# EAGLE design 10MHzRefOsc_2V3 (EAGLE 7.7.0)
DF4IAH - 10 MHz Reference Oscillator

## Sheet 1 of 3: Main
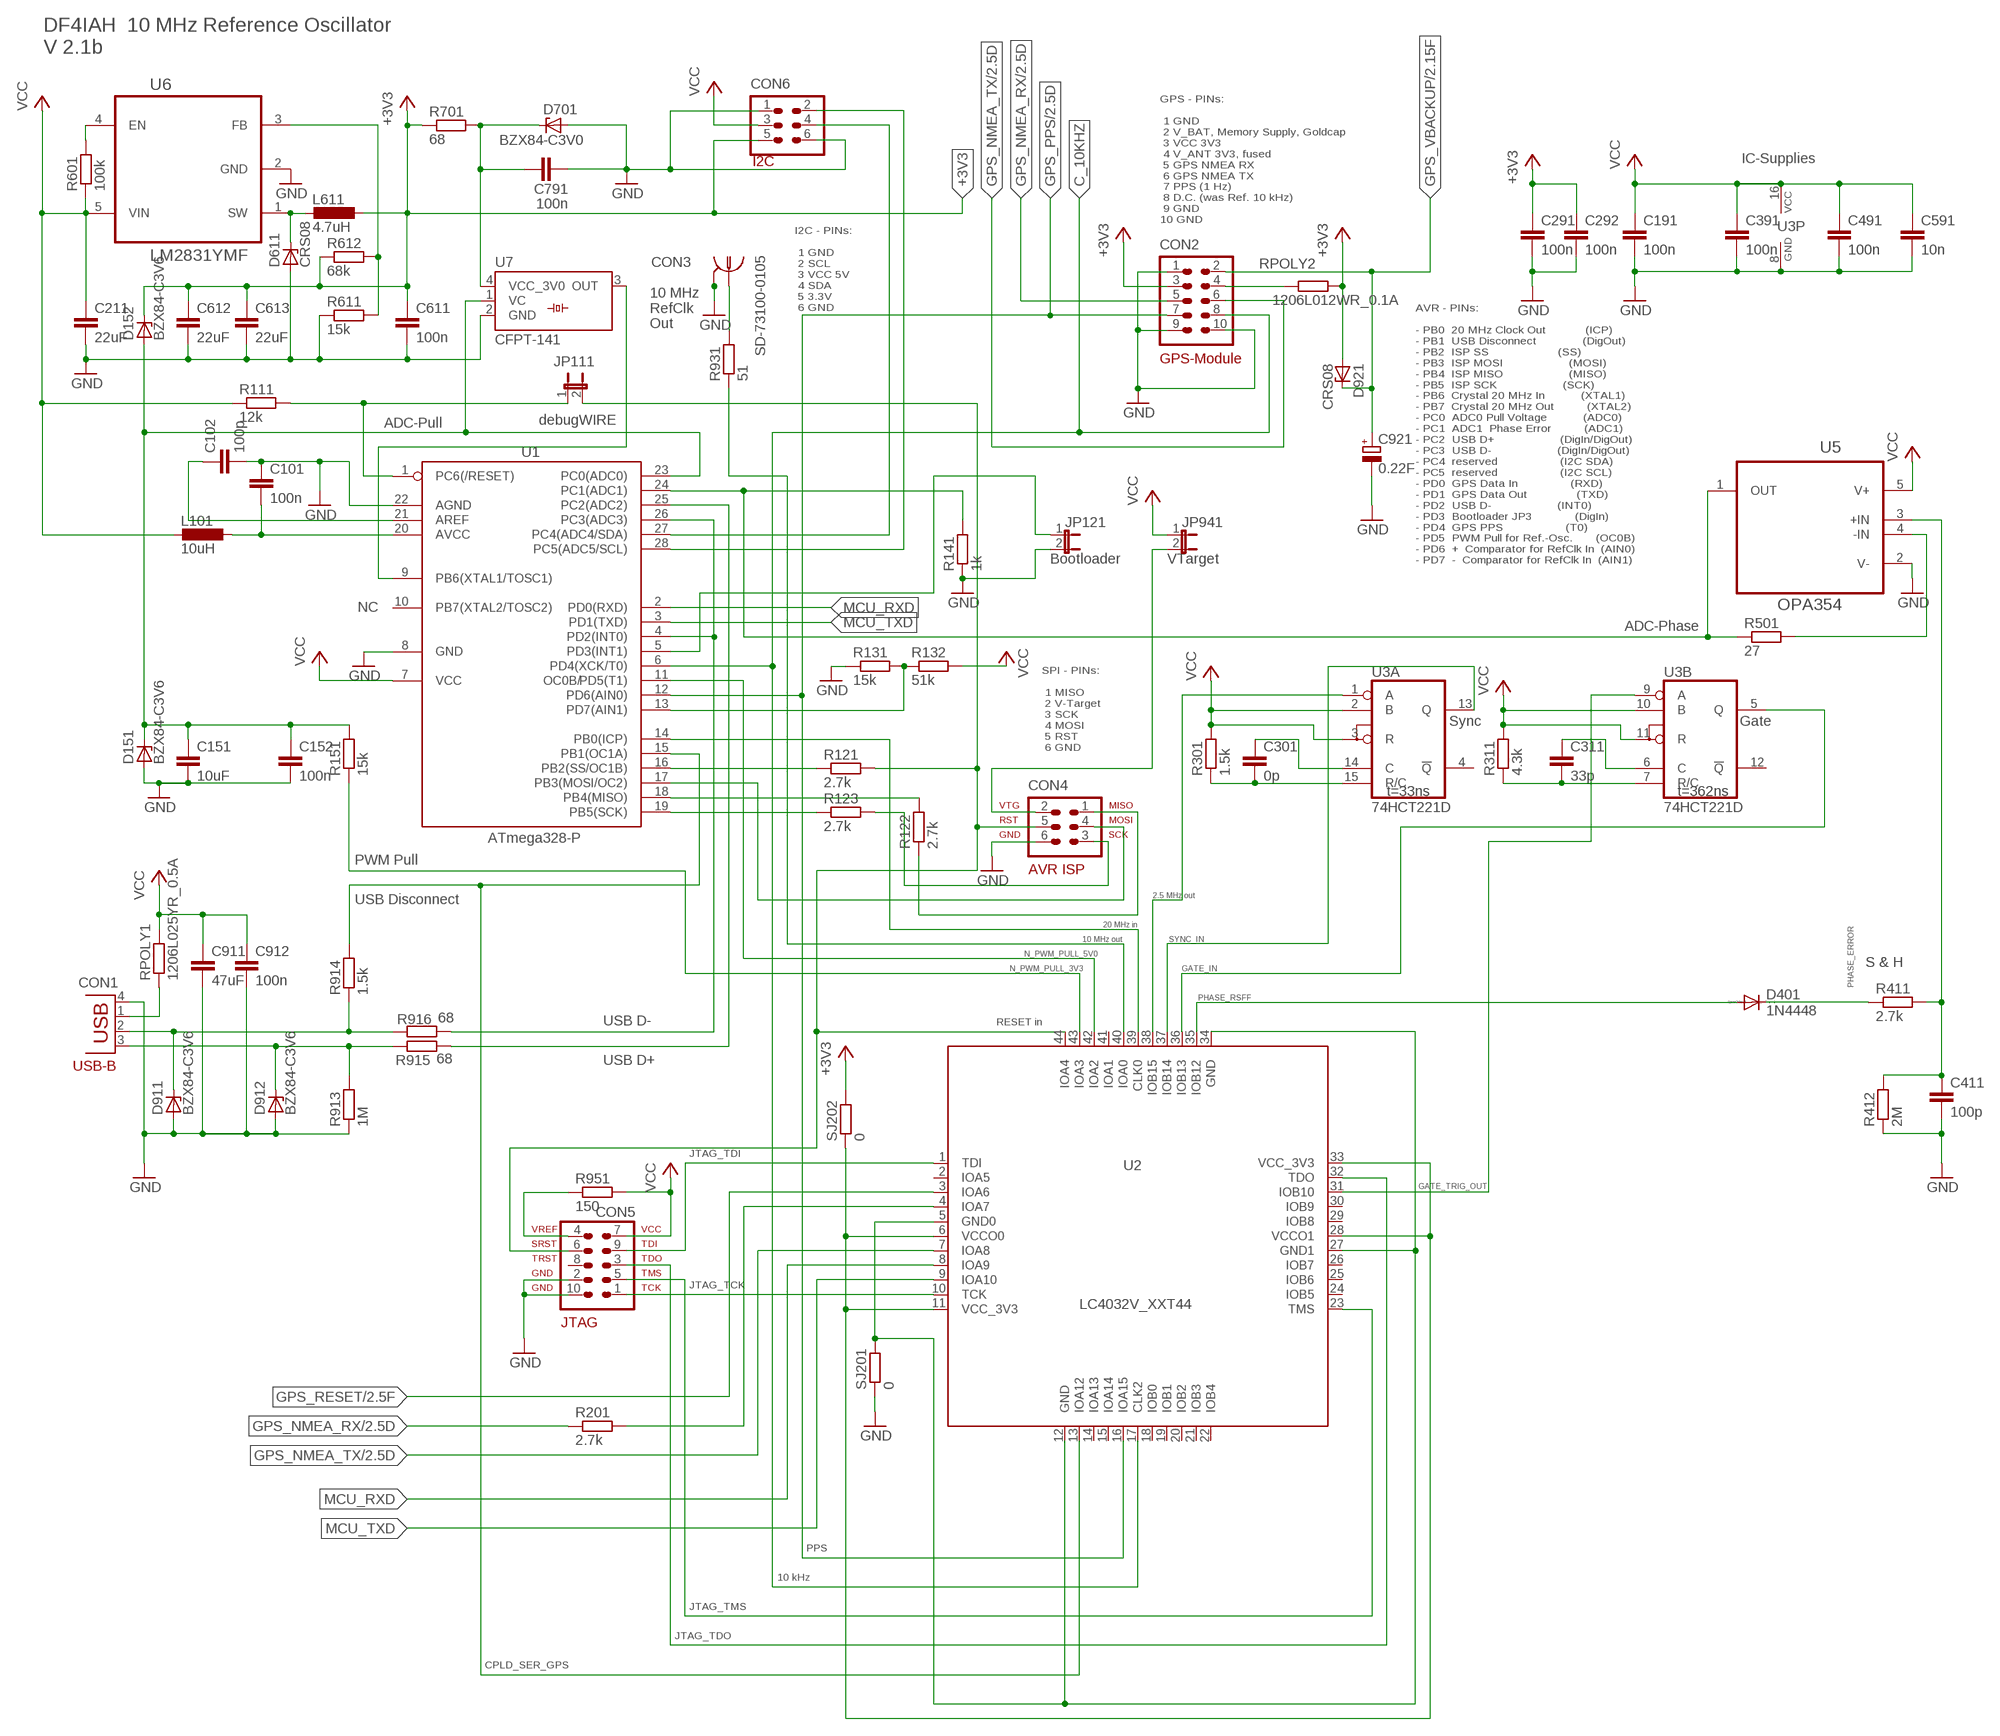
[diagram p0: schematic, sheet 1]

### Parts
C101  100n  C-EUC0805  [C0805]
C102  100p  C-EUC0805  [C0805]
C151  10uF  C-EUC0805  [C0805]
C152  100n  C-EUC0805  [C0805]
C191  100n  C-EUC0805  [C0805]
C211  22uF  C-EUC0805  [C0805]
C291  100n  C-EUC0805  [C0805]
C292  100n  C-EUC0805  [C0805]
C301  0p  C-EUC0805  [C0805]
C311  33p  C-EUC0805  [C0805]
C391  100n  C-EUC0805  [C0805]
C411  100p  C-EUC0805  [C0805]
C491  100n  C-EUC0805  [C0805]
C591  10n  C-EUC0805  [C0805]
C611  100n  C-EUC0805  [C0805]
C612  22uF  C-EUC0805  [C0805]
C613  22uF  C-EUC0805  [C0805]
C791  100n  C-EUC0805  [C0805]
C911  47uF  C-EUC0805  [C0805]
C912  100n  C-EUC0805  [C0805]
C921  0.22F  CPOL-EU140CLH-1010  [140CLH-1010]
CON1  TYCO-AMP_USBUSB-B_SMT  [TYCO-AMP_USB-B_SMT]
CON2  HEADER-2X5SMD  [2X5SMD]
CON3  SD-73100-0105  MOLEX_BNC-JACK-50R_SD-73100-0105  [MOLEX_BNC-JACK-50R_SD-73100-0105]
CON4  AVR-ISP-6SMD  [2X3SMD]
CON5  AVR-JTAG-10SMD  [2X5SMD]
CON6  HEADER-2X3SMD  [2X03SMD]
D151  BZX84-C3V6  BZX84CSMD  [TO236]
D152  BZX84-C3V6  BZX84CSMD  [TO236]
D401  1N4448  DIODE-SOD123  [SOD123]
D611  CRS08  ZENER-DIODESOD80C  [SOD80C]
D701  BZX84-C3V0  BZX84CSMD  [TO236]
D911  BZX84-C3V6  BZX84CSMD  [TO236]
D912  BZX84-C3V6  BZX84CSMD  [TO236]
D921  CRS08  ZENER-DIODESOD80C  [SOD80C]
JP111  JP1E  [JP1]
JP121  JP1E  [JP1]
JP941  JP1E  [JP1]
L101  10uH  L-EUL1812  [L1812]
L611  4.7uH  L-EUL5650M  [L5650M]
R111  12k  R-EU_R0805  [R0805]
R121  2.7k  R-EU_R0805  [R0805]
R122  2.7k  R-EU_R0805  [R0805]
R123  2.7k  R-EU_R0805  [R0805]
R131  15k  R-EU_R0805  [R0805]
R132  51k  R-EU_R0805  [R0805]
R141  1k  R-EU_R0805  [R0805]
R151  15k  R-EU_R0805  [R0805]
R201  2.7k  R-EU_R0805  [R0805]
R301  1.5k  R-EU_R0805  [R0805]
R311  4.3k  R-EU_R0805  [R0805]
R411  2.7k  R-EU_R0805  [R0805]
R412  2M  R-EU_R0805  [R0805]
R501  27  R-EU_R0805  [R0805]
R601  100k  R-EU_R0805  [R0805]
R611  15k  R-EU_R0805  [R0805]
R612  68k  R-EU_R0805  [R0805]
R701  68  R-EU_R0805  [R0805]
R913  1M  R-EU_R0805  [R0805]
R914  1.5k  R-EU_R0805  [R0805]
R915  68  R-EU_R0805  [R0805]
R916  68  R-EU_R0805  [R0805]
R931  51  R-EU_R0805  [R0805]
R951  150  R-EU_R0805  [R0805]
RPOLY1  1206L025YR_0.5A  R-EU_M1206  [M1206]
RPOLY2  1206L012WR_0.1A  R-EU_M1206  [M1206]
SJ201  0  R-EU_R0805  [R0805]
SJ202  0  R-EU_R0805  [R0805]
U1  ATmega328-P  MEGA8-P  [DIL28-3]
U2  LC4032V_XXT44  [TQFP44]
U3  74HCT221D  [SO16]
U5  OPA354  [SOT-23-5]
U6  LM2831YMF  [SOT95P280X145-5N]
U7  CFPT-141  [CFPT-141]

### Nets
+3V0 [N3V3]: C791.1 D701.C R701.2 U7.4(VCC_3V0)
+3V3 [N3V3]: C291.1 C292.1 C611.1 C612.1 C613.1 CON2.3 CON6.5 D152.C D921.A L611.1 R612.1 R701.1 RPOLY2.2 SJ202.2 ; also sheet 2
ADC_PHASE: R141.2 R501.1 U1.24(PC1(ADC1)) U5.1(OUT)
ADC_PHASE_SAMPLEHOLD: C411.1 R411.2 R412.2 U5.3(+IN)
AIN1: R131.2 R132.1 U1.13(PD7(AIN1))
AREF: C102.1 U1.21(AREF)
AVCC: C101.2 L101.1 U1.20(AVCC)
C_2MHZ5: U2.38(IOB15) U3.1(A:A)
C_10KHZ: CON2.8 U1.6(PD4(XCK/T0)) U2.17(CLK2)
C_10MHZ: R931.1 U2.40(IOA0)
C_20MHZ: U1.14(PB0(ICP)) U2.39(CLK0)
CPLD_GPS_NMEA_RX: R201.2 U2.4(IOA7)
EN: R601.2 U6.4(EN)
FB: R611.2 R612.2 U6.3(FB)
GATE_IN: U2.36(IOB13) U3.5(B:Q)
GATE_TRIG_OUT: U2.31(IOB10) U3.9(B:A)
GND [N0V]: C101.1 C102.2 C151.2 C152.2 C191.2 C211.2 C291.2 C292.2 C391.2 C411.2 C491.2 C591.2 C611.2 C612.2 C613.2 C791.2 C911.2 C912.2 C921.- CON1.4(GND) CON2.1 CON2.9 CON2.10 CON3.2 CON3.3 CON4.6 CON5.2 CON5.10 CON6.1 CON6.6 D151.A D611.A D701.A D911.A D912.A JP121.2 R131.1 R141.1 R412.1 R611.1 R913.1 SJ201.1 U1.8(GND) U1.22(AGND) U3.8(P:GND) U5.2(V-) U6.2(GND) U7.2(GND) ; also sheet 2,3
GND_SJ1: SJ201.2 U2.5(GND0) U2.12(GND) U2.27(GND1) U2.34(GND)
GPS_ANT_PWR [N5V]: CON2.4 RPOLY2.1
GPS_NMEA_RX: CON2.5 R201.1 ; also sheet 2
GPS_NMEA_TX: CON2.6 U2.7(IOA8) ; also sheet 2
GPS_PPS: CON2.7 U1.12(PD6(AIN0)) U2.16(IOA15) ; also sheet 2
GPS_RESET: U2.3(IOA6) ; also sheet 2
GPS_VBACKUP: C921.+ CON2.2 D921.C ; also sheet 2
INT1: JP121.1 U1.5(PD3(INT1))
ISP_MISO: CON4.1 R122.1
ISP_MOSI: CON4.4 U1.17(PB3(MOSI/OC2))
ISP_SCK: CON4.3 R123.2
ISP_VTARGET: CON4.2 JP941.2
JTAG_SRST: CON4.5 CON5.6 JP111.2 R121.2 U2.44(IOA4)
JTAG_TCK: CON5.1 U2.10(TCK)
JTAG_TDI: CON5.9 U2.1(TDI)
JTAG_TDO: CON5.3 U2.32(TDO)
JTAG_TMS: CON5.5 U2.23(TMS)
JTAG_VREF: CON5.4 R951.1
MCU_RXD: U1.2(PD0(RXD)) U2.8(IOA9)
MCU_TXD: U1.3(PD1(TXD)) U2.9(IOA10)
MISO: R122.2 U1.18(PB4(MISO))
N$1: CON6.2 U1.28(PC5(ADC5/SCL))
N$3: CON6.4 U1.27(PC4(ADC4/SDA))
N$42: CON3.1 R931.2
N$44: C311.2 R311.1 U3.7(B:R/C)
N$45: C311.1 U3.6(B:C)
N$47: C301.2 R301.1 U3.15(A:R/C)
N$48: C301.1 U3.14(A:C)
N_ADC_PULL: C151.1 C152.1 D151.C D152.A R151.2 U1.23(PC0(ADC0)) U7.1(VC)
N_PWM_PULL_3V3: R151.1 U2.43(IOA3)
N_PWM_PULL_5V0: U1.11(PD5(T1)) U2.42(IOA2)
N_USB_DISC: R914.2 U1.15(PB1(OC1A)) U2.13(IOA12)
N_USB_DMNS: R916.2 U1.4(PD2(INT0)) U1.26(PC3(ADC3))
N_USB_DPLS: R915.2 U1.25(PC2(ADC2))
PHASE_ERROR: D401.C R411.1
PHASE_RSFF: D401.A U2.35(IOB12)
RESET: JP111.1 R111.2 U1.1(PC6(/RESET))
SCK: R123.1 U1.19(PB5(SCK))
SS: R121.1 U1.16(PB2(SS/OC1B))
SW [N3V3]: D611.C L611.2 U6.1(SW)
SYNC_IN: U2.37(IOB14) U3.13(A:Q)
TOSC1: U1.9(PB6(XTAL1/TOSC1)) U7.3(OUT)
U5_FB: R501.2 U5.4(-IN)
USB_D_MIN: CON1.2(D-) D911.C R914.1 R916.1
USB_D_PLS: CON1.3(D+) D912.C R913.2 R915.1
USB_PWR: CON1.1(VBUS) RPOLY1.1
VCC [N5V]: C191.1 C211.1 C391.1 C491.1 C591.1 C911.1 C912.1 CON5.7 CON6.3 JP941.1 L101.2 R111.1 R132.2 R301.2 R311.2 R601.1 R951.2 RPOLY1.2 U1.7(VCC) U3.2(A:B) U3.3(A:R) U3.10(B:B) U3.11(B:R) U3.16(P:VCC) U5.5(V+) U6.5(VIN)
VCC_3V3_SJ2: SJ202.1 U2.6(VCCO0) U2.11(VCC_3V3) U2.28(VCCO1) U2.33(VCC_3V3)
Unconnected: CON5.8 U1.10(PB7(XTAL2/TOSC2)) U2.2(IOA5) U2.14(IOA13) U2.15(IOA14) U2.18(IOB0) U2.19(IOB1) U2.20(IOB2) U2.21(IOB3) U2.22(IOB4) U2.24(IOB5) U2.25(IOB6) U2.26(IOB7) U2.29(IOB8) U2.30(IOB9) U2.41(IOA1) U3.4(A:!Q) U3.12(B:!Q)

### Notes on the sheet
- DF4IAH  10 MHz Reference Oscillator
  V 2.1b
- I2C | IC-Supplies
- GPS - PINs:
  
   1 GND
   2 V_BAT, Memory Supply, Goldcap
   3 VCC 3V3
   4 V_ANT 3V3, fused
   5 GPS NMEA RX
   6 GPS NMEA TX
   7 PPS (1 Hz)
   8 D.C. (was Ref. 10 kHz)
   9 GND
  10 GND
- I2C - PINs:
  
   1 GND
   2 SCL
   3 VCC 5V
   4 SDA
   5 3.3V
   6 GND
- 10 MHz
  RefClk
  Out
- GPS-Module
- ADC-Pull | debugWIRE
- Bootloader | VTarget
- AVR - PINs:
  
  - PB0  20 MHz Clock Out            (ICP)
  - PB1  USB Disconnect              (DigOut)
  - PB2  ISP SS                     (SS)
  - PB3  ISP MOSI                    (MOSI)
  - PB4  ISP MISO                    (MISO)
  - PB5  ISP SCK                    (SCK)
  - PB6  Crystal 20 MHz In           (XTAL1)
  - PB7  Crystal 20 MHz Out          (XTAL2)
  - PC0  ADC0 Pull Voltage           (ADC0)
  - PC1  ADC1  Phase Error          (ADC1)
  - PC2  USB D+                    (DigIn/DigOut)
  - PC3  USB D-                    (DigIn/DigOut)
  - PC4  reserved                   (I2C SDA)
  - PC5  reserved                   (I2C SCL)
  - PD0  GPS Data In                (RXD)
  - PD1  GPS Data Out               (TXD)
  - PD2  USB D-                    (INT0)
  - PD3  Bootloader JP3             (DigIn)
  - PD4  GPS PPS                   (T0)
  - PD5  PWM Pull for Ref.-Osc.       (OC0B)
  - PD6  +  Comparator for RefClk In  (AIN0)
  - PD7  -  Comparator for RefClk In  (AIN1)
- NC
- ADC-Phase
- OC0B/
- Sync | Gate
- SPI - PINs:
  
   1 MISO
   2 V-Target
   3 SCK
   4 MOSI
   5 RST
   6 GND
- t=33ns | t=362ns
- PWM Pull
- 2.5 MHz out
- USB Disconnect
- 20 MHz in
- 10 MHz out
- S & H
- USB D- | RESET in
- USB D+
- USB-B
- JTAG_TDI
- JTAG_TCK
- PPS
- 10 kHz
- JTAG_TMS
- JTAG_TDO
- CPLD_SER_GPS

## Sheet 2 of 3: GPS-Unit
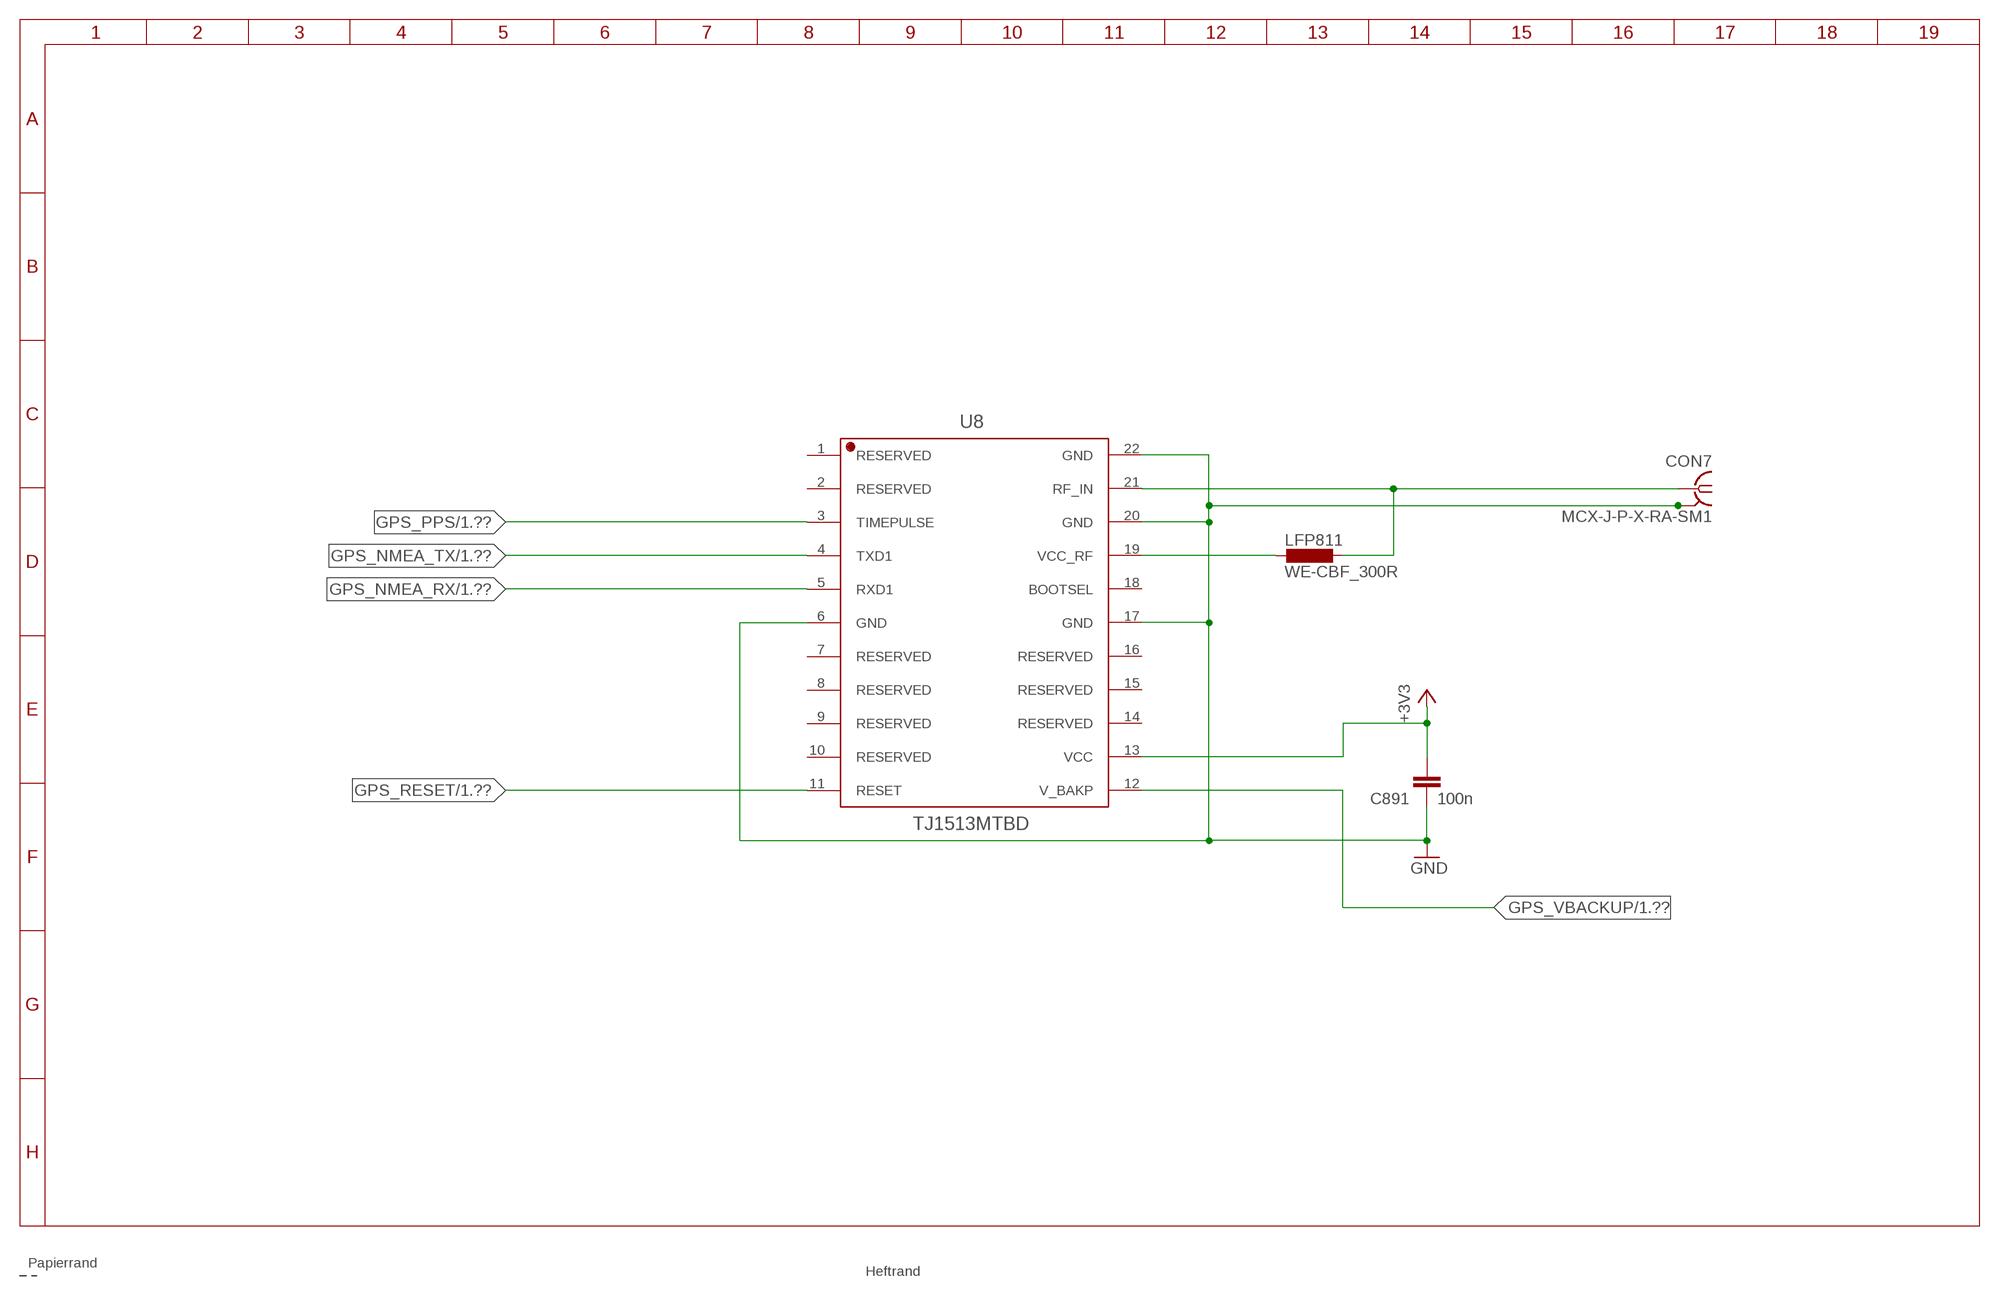
[diagram p1: schematic, sheet 2]

### Parts
C891  100n  C-EUC0805  [C0805]
CON7  MCX-J-P-X-RA-SM1  [MCX-J-P-X-RA-SM1]
LFP811  WE-CBF_300R  L-EUL3216C  [L3216C]
U8  TJ1513MTBD  [TJ1513MTBD]

### Nets
+3V3 [N3V3]: C891.1 U8.13(VCC) ; also sheet 1
GND [N0V]: C891.2 CON7.2 CON7.3 CON7.4 CON7.5 U8.6(GND) U8.17(GND) U8.20(GND) U8.22(GND) ; also sheet 1,3
GPS_HF: CON7.1 LFP811.1 U8.21(RF_IN)
GPS_NMEA_RX: U8.5(RXD1) ; also sheet 1
GPS_NMEA_TX: U8.4(TXD1) ; also sheet 1
GPS_PPS: U8.3(TIMEPULSE) ; also sheet 1
GPS_RESET: U8.11(RESET) ; also sheet 1
GPS_VBACKUP: U8.12(V_BAKP) ; also sheet 1
N$2: LFP811.2 U8.19(VCC_RF)
Unconnected: U8.1(RESERVED) U8.2(RESERVED) U8.7(RESERVED) U8.8(RESERVED) U8.9(RESERVED) U8.10(RESERVED) U8.14(RESERVED) U8.15(RESERVED) U8.16(RESERVED) U8.18(BOOTSEL)

## Sheet 3 of 3: Mount-Pads
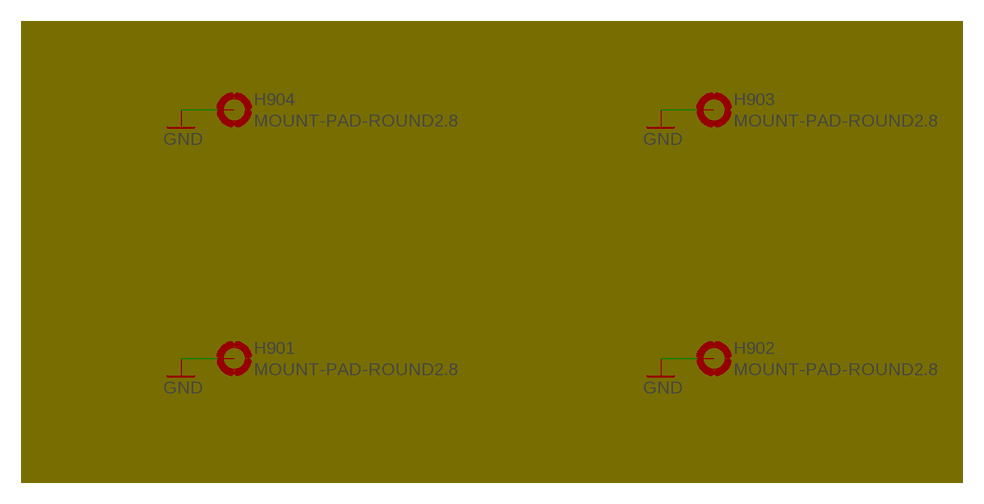
[diagram p2: schematic, sheet 3]

### Parts
H901  MOUNT-PAD-ROUND2.8  [2,8-PAD]
H902  MOUNT-PAD-ROUND2.8  [2,8-PAD]
H903  MOUNT-PAD-ROUND2.8  [2,8-PAD]
H904  MOUNT-PAD-ROUND2.8  [2,8-PAD]

### Nets
GND [N0V]: H901.B2,8(MOUNT) H902.B2,8(MOUNT) H903.B2,8(MOUNT) H904.B2,8(MOUNT) ; also sheet 1,2

## Library data of the parts
C101 C102 C151 C152 C191 C211 C291 C292 C301 C311 C391 C411 C491 C591 C611-C613 C791 C911 C912 = rcl:C-EU: CAPACITOR, European symbol
C891 = df4iah:C-EU: CAPACITOR, European symbol
C921 = rcl:CPOL-EU: POLARIZED CAPACITOR, European symbol
CON1 = df4iah:TYCO-AMP_USB: TYCO-AMP USB-Connectors From Catalog 7-1773422-0 Issued 03-06; MF: TYCO-AMP; MPN: 1734346; OC_FARNELL: 1321918
CON2 = df4iah:HEADER-2X5: Header 2X5 2.54mm ISP, JTAG, ...
CON3 = df4iah:MOLEX_BNC-JACK-50R_SD-73100-0105: MOLEX BNC-Jack 50 Ohm SD-73100-0102; MF: MOLEX; MPN: SD-73100-0105; OC_FARNELL: 1909203; OC_NEWARK: -
CON4 = atmel-1:AVR-ISP-6: AVR ISP-6 Serial Programming Header
CON5 = df4iah:AVR-JTAG-10: AVR JTAG Debug/Programming Header
CON6 = df4iah:HEADER-2X3: Header 2X3 2.54mm ISP, ...
CON7 = df4iah:MCX-J-P-X-RA-SM1: FEMALE SMA CONNECTOR Radiall
D151 D152 D701 D911 D912 = diode:BZX84CSMD: Z DIODE
D401 = diode:DIODE-: DIODE
D611 D921 = diode:ZENER-DIODE: Z-Diode
H901-H904 = holes:MOUNT-PAD-ROUND: MOUNTING PAD, round
JP111 JP121 JP941 = jumper:JP1E: JUMPER
L101 L611 = rcl:L-EU: INDUCTOR, European symbol
LFP811 = df4iah:L-EU: INDUCTOR, European symbol
R111 R121-R123 R131 R132 R141 R151 R201 R301 R311 R411 R412 R501 R601 R611 R612 R701 R913-R916 R931 R951 RPOLY1 RPOLY2 SJ201 SJ202 = rcl:R-EU_: RESISTOR, European symbol
U1 = atmel:MEGA8-P: MICROCONTROLLER 8 Kbytes FLASH 1 kbytes SRAM 512 bytes EEPROM USART 4-channel 10 bit ADC 2-channel 8 bit ADC
U2 = df4iah:LC4032V_XXT44: bsdliscispmach4032v44pintqfp Auto generated by make-symbol-device-package-bsdl.ulp Rev. 44 Source: bsdliscispmach4032v44pintqfp.BSM Created by: DF4IAH
U3 = 74xx-eu:74*221: Dual Monostable MULTIVIBRATOR, schmitt trigger inputs
U5 = df4iah_opamp:OPA354: CMOS OPERATIONAL AMPLIFIERS; MPN: OPA354AIDBVT; OC_FARNELL: 1207050; OC_NEWARK: -; PACKAGE: SOT-23-5; SUPPLIER: Texas Instruments
U6 = df4iah:LM2831: HIGH-EFFICIENCY, SOT23 STEP-DOWN, DC-DC CONVERTER; MPN: LM2831YMF/NOPB; OC_FARNELL: 1286714; OC_NEWARK: -; PACKAGE: SOT-23-5; SUPPLIER: National Semiconductor
U7 = df4iah:CFPT-141: TCXO, 3.0V; MF: IQD-FREQUENCY-PRODUCTS; MPN: LFTVXO022175; OC_FARNELL: 1100745; OC_NEWARK: -
U8 = df4iah_gps:TJ1513MTBD: TJ1513MTBD based on MediaTek MT3333 Many brands like: MediaTek, SkyLab, T.JWL and others GNSS Receiver Module for GPS, QZSS, Galileo and Beidou data entry: 2015-04-08 by DF4IAH.; OC_ALIBABA: TJ1513MTBD; OC_FARNELL: -; OC_NEWARK: -

## Net classes
1 N3V3: width 0.508 mm
2 N5V: width 0.508 mm
3 N0V: width 0.508 mm

## Board
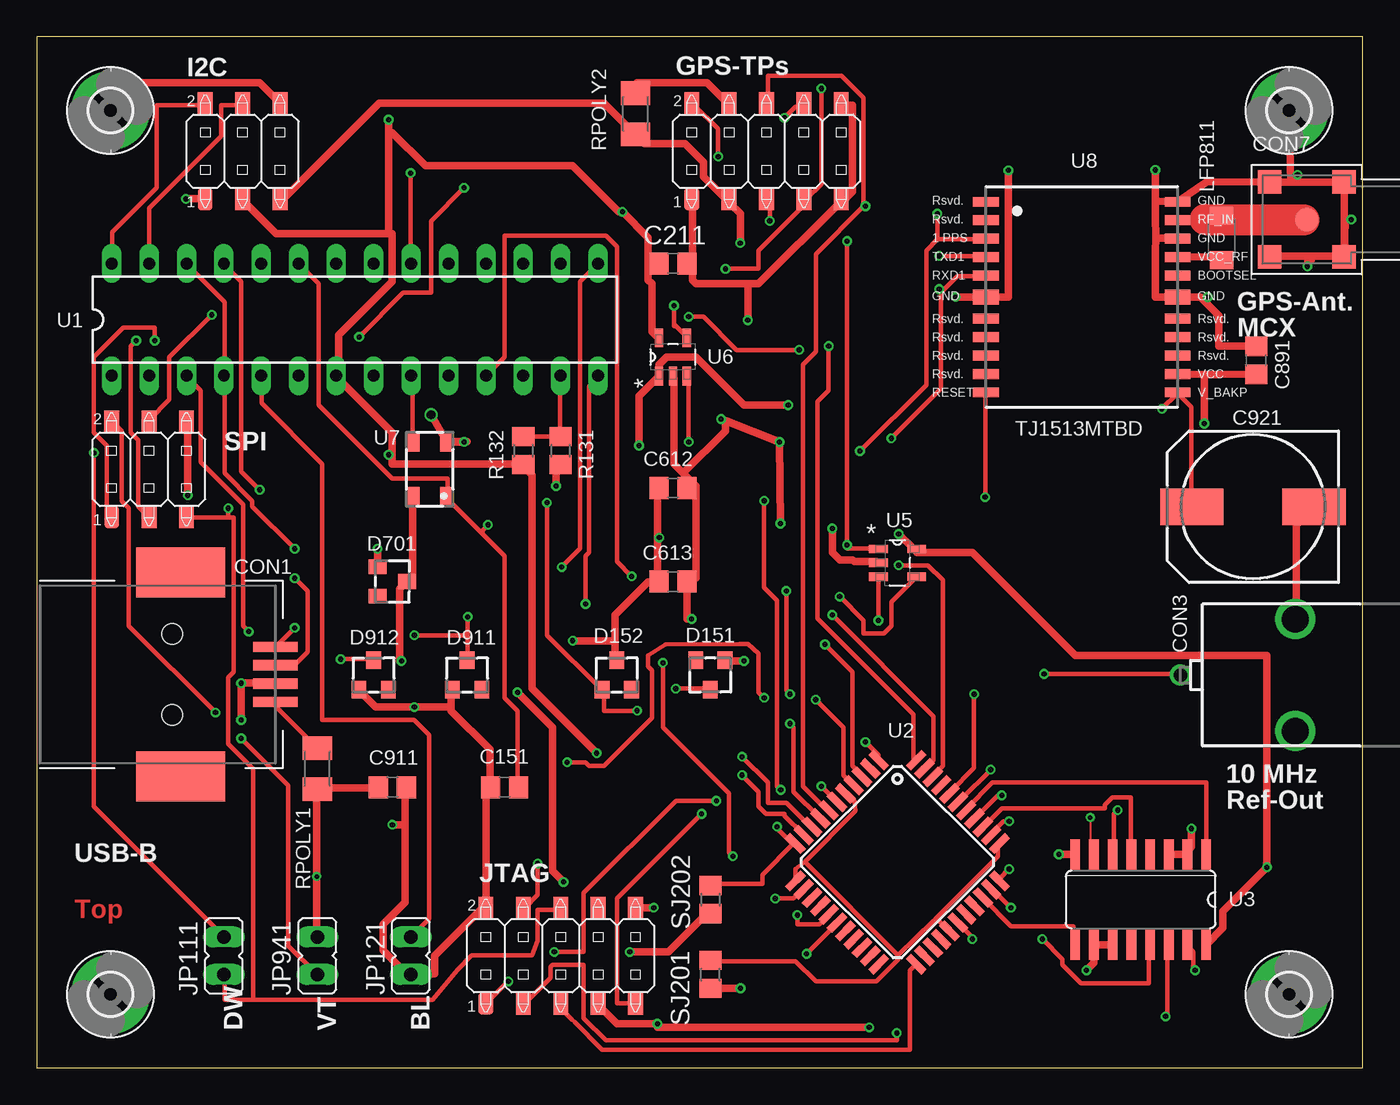
[diagram p3: board, top side]
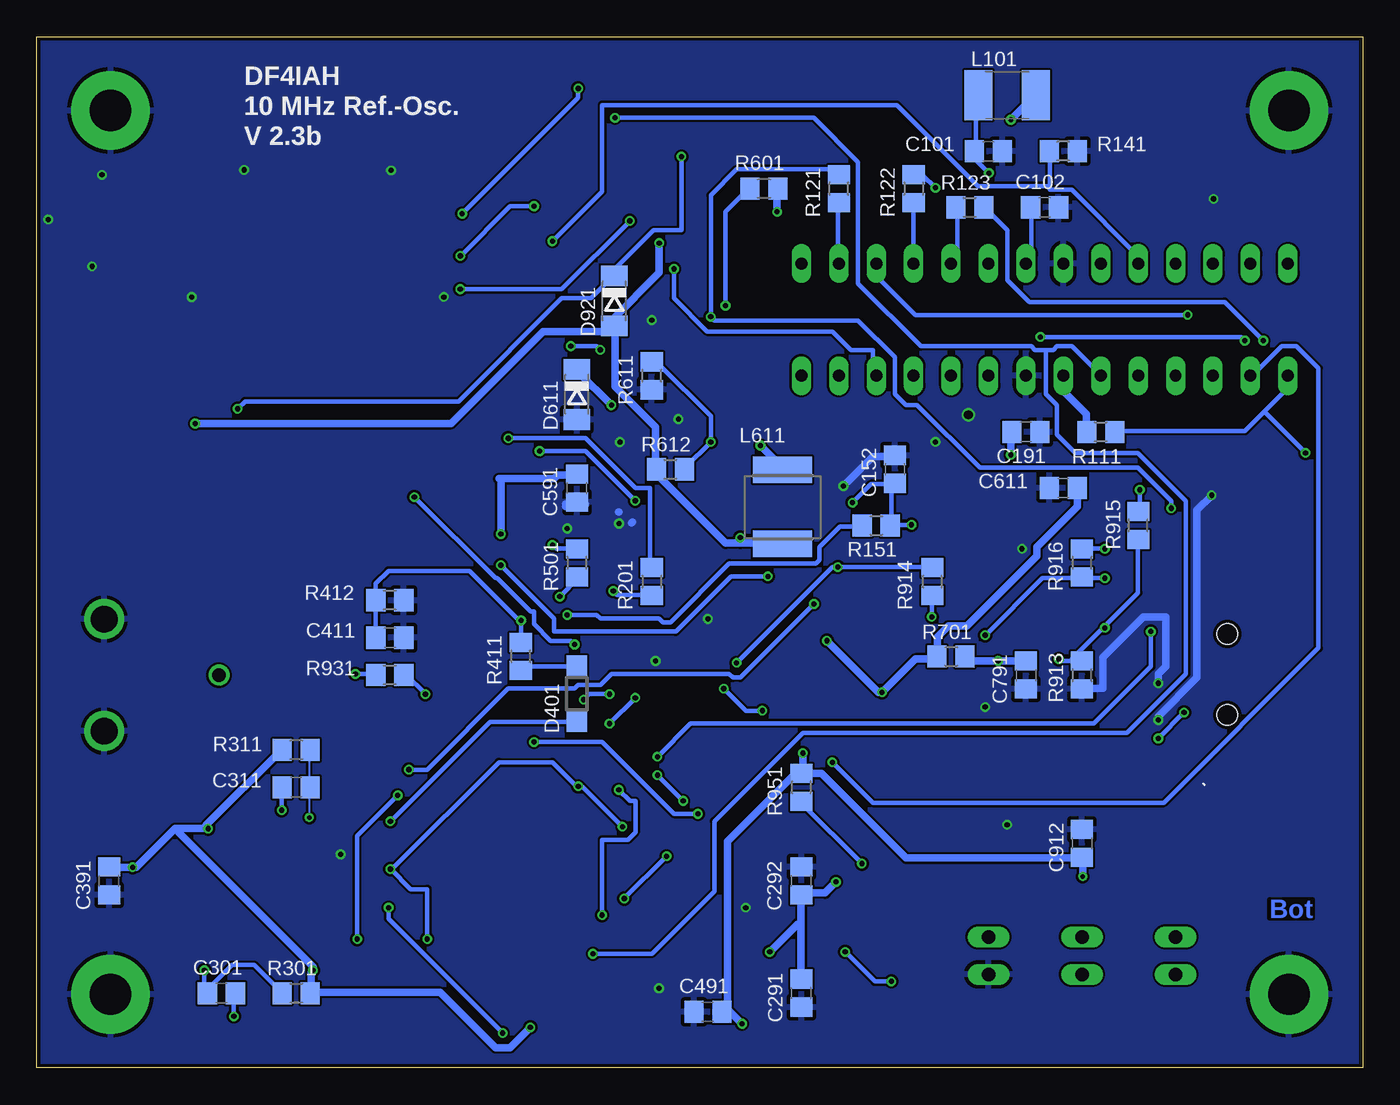
[diagram p4: board, bottom side, seen from below]

Size 90 x 70 mm. Coordinates in mm from the lower left corner, seen from the top.
Outline: 0,0 90,0 90,70 0,70 0,0
Copper layers (1*16): Top 0.035mm / dielectric 1.5mm / Bottom 0.035mm
Design rules "DirtyPCBs_2layers_0mm3_20150325": minimum track width 6mil, minimum drill 12mil, track to track 6mil, track to pad 6mil, pad to pad 6mil, via to via 6mil, smd to smd 0mil, copper to edge 10mil, drill to drill 10mil, minimum pad ring 10mil, minimum via ring 6mil, stop-mask expansion 2mil, vias tented up to drill 25mil, thermal gap 10mil

### Footprints (pad centres in the part's own frame; a part is rotated, then mirrored left to right if it is on the bottom)
C0805 = smd 1.3 x 1.5: 1 -0.95,0; 2 0.95,0
140CLH-1010 = smd 4.3 x 2.5: + 4.15,0; - -4.15,0
TYCO-AMP_USB-B_SMT = smd 6.04 x 3.4: 0A 0,6.92; 0B 0,-6.92 | smd 3 x 0.7: 1 -6.42,1.87; 2 -6.42,-0.62; 3 -6.42,-1.87; 4 -6.42,0.62 | hole 1.4: 0.58,-2.75; 0.58,2.75
2X5SMD = smd 1 x 1.5: 1 -5.08,-3.25; 2 -5.08,3.25; 3 -2.54,-3.25; 4 -2.54,3.25; 5 0,-3.25; 6 0,3.25; 7 2.54,-3.25; 8 2.54,3.25; 9 5.08,-3.25; 10 5.08,3.25
MOLEX_BNC-JACK-50R_SD-73100-0105 = drill 0.92: 1 12.4,0 | drill 1.8: 2 4.6,3.8; 3 4.6,-3.8
2X3SMD = smd 1 x 1.5: 1 -2.54,-3.25; 2 -2.54,3.25; 3 0,-3.25; 4 0,3.25; 5 2.54,-3.25; 6 2.54,3.25
2X03SMD = smd 1 x 1.5: 1 -2.54,-3.25; 2 -2.54,3.25; 3 0,-3.25; 4 0,3.25; 5 2.54,-3.25; 6 2.54,3.25
MCX-J-P-X-RA-SM1 = smd 1.6 x 1.6: 1 0,0; 2 -2.54,2.54; 3 2.54,2.54; 4 -2.54,-2.54; 5 2.54,-2.54
TO236 = smd 1 x 1.2: A -1,-1; C 0,1; NC 1,-1
SOD123 = smd 1.4 x 1.4: A 1.9,0; C -1.9,0
SOD80C = smd 1.4 x 1.8: A 1.7,0; C -1.7,0
2,8-PAD = drill 2.8 pad 5.334: B2,8 0,0
JP1 = drill 0.914 long: 1 0,-1.27; 2 0,1.27
L1812 = smd 1.9 x 3.4: 1 -1.95,0; 2 1.95,0
L5650M = smd 1.8 x 4: 1 -2.5,0; 2 2.5,0
L3216C = smd 1.2 x 1.6: 1 -1.5,0; 2 1.5,0
R0805 = smd 1.3 x 1.5: 1 -0.95,0; 2 0.95,0
M1206 = smd 1.6 x 2: 1 -1.4,0; 2 1.4,0
DIL28-3 = drill 0.813 long: 1 -16.51,-3.81; 2 -13.97,-3.81; 3 -11.43,-3.81; 4 -8.89,-3.81; 5 -6.35,-3.81; 6 -3.81,-3.81; 7 -1.27,-3.81; 8 1.27,-3.81; 9 3.81,-3.81; 10 6.35,-3.81; 11 8.89,-3.81; 12 11.43,-3.81; 13 13.97,-3.81; 14 16.51,-3.81; 15 16.51,3.81; 16 13.97,3.81; 17 11.43,3.81; 18 8.89,3.81; 19 6.35,3.81; 20 3.81,3.81; 21 1.27,3.81; 22 -1.27,3.81; 23 -3.81,3.81; 24 -6.35,3.81; 25 -8.89,3.81; 26 -11.43,3.81; 27 -13.97,3.81; 28 -16.51,3.81
TQFP44 = smd 1.5 x 0.5: 1 -5.8,4; 2 -5.8,3.2; 3 -5.8,2.4; 4 -5.8,1.6; 5 -5.8,0.8; 6 -5.8,0; 7 -5.8,-0.8; 8 -5.8,-1.6; 9 -5.8,-2.4; 10 -5.8,-3.2; 11 -5.8,-4; 23 5.8,-4; 24 5.8,-3.2; 25 5.8,-2.4; 26 5.8,-1.6; 27 5.8,-0.8; 28 5.8,0; 29 5.8,0.8; 30 5.8,1.6; 31 5.8,2.4; 32 5.8,3.2; 33 5.8,4 | smd 0.5 x 1.5: 12 -4,-5.8; 13 -3.2,-5.8; 14 -2.4,-5.8; 15 -1.6,-5.8; 16 -0.8,-5.8; 17 0,-5.8; 18 0.8,-5.8; 19 1.6,-5.8; 20 2.4,-5.8; 21 3.2,-5.8; 22 4,-5.8; 34 4,5.8; 35 3.2,5.8; 36 2.4,5.8; 37 1.6,5.8; 38 0.8,5.8; 39 0,5.8; 40 -0.8,5.8; 41 -1.6,5.8; 42 -2.4,5.8; 43 -3.2,5.8; 44 -4,5.8
SO16 = smd 0.66 x 2.032: 1 -4.445,-3.073; 2 -3.175,-3.073; 3 -1.905,-3.073; 4 -0.635,-3.073; 5 0.635,-3.073; 6 1.905,-3.073; 7 3.175,-3.073; 8 4.445,-3.073; 9 4.445,3.073; 10 3.175,3.073; 11 1.905,3.073; 12 0.635,3.073; 13 -0.635,3.073; 14 -1.905,3.073; 15 -3.175,3.073; 16 -4.445,3.073
SOT-23-5 = smd 1.27 x 0.559: 1 -1.295,0.94; 2 -1.295,0; 3 -1.295,-0.94; 4 1.295,-0.94; 5 1.295,0.94
SOT95P280X145-5N = smd 1.27 x 0.559: 1 -1.295,0.94; 2 -1.295,0; 3 -1.295,-0.94; 4 1.295,-0.94; 5 1.295,0.94
CFPT-141 = smd 1.4 x 0.9: 1 -1.9,-1.15; 2 1.9,-1.15; 3 1.9,1.15; 4 -1.9,1.15
TJ1513MTBD = smd 1.75 x 0.667: 1 -6.35,6.58; 2 -6.35,5.33; 3 -6.35,4.08; 4 -6.35,2.83; 5 -6.35,1.58; 7 -6.35,-1.35; 8 -6.35,-2.6; 9 -6.35,-3.85; 10 -6.35,-5.1; 11 -6.35,-6.35; 12 6.65,-6.35; 13 6.65,-5.1; 14 6.65,-3.85; 15 6.65,-2.6; 16 6.65,-1.35; 18 6.65,1.58; 19 6.65,2.83; 20 6.65,4.08; 21 6.65,5.33; 22 6.65,6.58 | smd 1.75 x 1: 6 -6.35,0.12; 17 6.65,0.12

### Placement (x,y rotation side)
C101  25.4,62.23 180 bottom
C102  21.59,58.42 0 bottom
C151  31.75,19.05 180 top
C152  31.75,40.64 90 bottom
C191  22.86,43.18 0 bottom
C211  43.18,54.61 0 top
C291  38.1,5.08 270 bottom
C292  38.1,12.7 90 bottom
C301  77.47,5.08 180 bottom
C311  72.39,19.05 0 bottom
C391  85.09,12.7 270 bottom
C411  66.04,29.21 0 bottom
C491  44.45,3.81 180 bottom
C591  53.34,39.37 270 bottom
C611  20.32,39.37 180 bottom
C612  43.18,39.37 0 top
C613  43.18,33.02 0 top
C791  22.86,26.67 270 bottom
C891  82.77,48.04 90 top
C911  24.13,19.05 0 top
C912  19.05,15.24 90 bottom
C921  82.55,38.1 180 top
CON1  9.78,26.71 180 top
CON2  49.53,62.23 0 top
CON3  90.03,26.67 180 top
CON4  7.62,40.64 0 top
CON5  35.56,7.62 0 top
CON6  13.97,62.23 0 top
CON7  86.2,57.6 270 top
D151  45.72,26.67 180 top
D152  39.37,26.67 0 top
D401  53.34,25.4 270 bottom
D611  53.34,45.72 270 bottom
D701  24.13,33.02 270 top
D911  29.21,26.67 0 top
D912  22.86,26.67 0 top
D921  50.8,52.07 270 bottom
H901  5,5 0 top
H902  85,5 0 top
H903  85,65 0 top
H904  5,65 0 top
JP111  12.7,7.62 180 top
JP121  25.4,7.62 180 top
JP941  19.05,7.62 180 top
L101  24.13,66.04 0 bottom
L611  39.37,38.1 90 bottom
LFP811  80.42,56.34 270 top
R111  17.78,43.18 0 bottom
R121  35.56,59.69 90 bottom
R122  30.48,59.69 270 bottom
R123  26.67,58.42 0 bottom
R131  35.56,41.91 90 top
R132  33.02,41.91 270 top
R141  20.32,62.23 180 bottom
R151  33.02,36.83 0 bottom
R201  48.26,33.02 270 bottom
R301  72.39,5.08 0 bottom
R311  72.39,21.59 180 bottom
R411  57.15,27.94 90 bottom
R412  66.04,31.75 180 bottom
R501  53.34,34.29 270 bottom
R601  40.64,59.69 180 bottom
R611  48.26,46.99 90 bottom
R612  46.99,40.64 0 bottom
R701  27.94,27.94 0 bottom
R913  19.05,26.67 90 bottom
R914  29.21,33.02 90 bottom
R915  15.24,36.83 90 bottom
R916  19.05,34.29 90 bottom
R931  66.04,26.67 180 bottom
R951  38.1,19.05 90 bottom
RPOLY1  19.05,20.32 270 top
RPOLY2  40.64,64.77 270 top
SJ201  45.72,6.35 90 top
SJ202  45.72,11.43 270 top
U1  21.59,50.8 0 top
U2  58.42,13.97 315 top
U3  74.93,11.43 180 top
U5  58.42,34.29 0 top
U6  43.18,48.26 90 top
U7  26.67,40.64 90 top
U8  70.78,52.21 0 top

### Tracks (layer width: path | path; a pad name or v marks a point on that pad's centre or on a via)
+3V0  (via drill 0.35)
  Top 0.508: U7.4 25.5,38.62 25.5,33.38 25.25,33.12 D701.C 25,32.88 24.62,32.5 24.62,27.62 v24.75,27.62
  Bottom 0.508: C791.1 22.88,27.62 v24.75,27.62 26.62,27.62 26.88,27.88 R701.2
+3V3  (via drill 0.35)
  Top 0.508: 39.25,29 39.25,27.75 D152.C | v40.25,7.88 42.88,7.88 45.62,10.62 45.75,10.5 SJ202.2 | v35.75,12.62 35,13.38 35,23.12 v32.62,25.5 | v36.38,29 39.25,29 | CON6.5 16.75,59 23.25,65.5 38.5,65.5 40.5,63.5 RPOLY2.2 40.75,63.25 41.25,62.75 44,62.75 45.25,61.5 45.25,60.5 46.75,59 CON2.3 47,58.75 47.75,58 v47.75,56 | 39.25,29 39.25,30.75 41.5,33 42.12,33 C613.1 42.12,33.25 42.12,36 | 42.12,36 42.12,39.25 C612.1 | v42.25,36 42.12,36 | U8.13 79.25,47.08 | 79.25,47.08 80.23,47.08 C891.1 | 79.25,47.08 v79.25,43.75
  Bottom 0.508: 42.25,35.62 39.38,35.62 L611.1 | 42.25,35.62 43.25,35.62 47.88,40.25 48,40.25 48,40.5 R612.1 48,40.75 48,43.5 50.75,46.25 50.75,50.25 D921.A | 38.12,9.75 38.12,11.75 C292.1 37.88,11.88 36.5,11.88 v35.75,12.62 | 38.12,9.75 38.12,6.12 C291.1 | v40.25,7.88 38.38,9.75 38.12,9.75 | C611.1 19.38,39.25 19.38,38.12 22.12,35.38 22.12,34.75 26.88,30 28.12,30 28.88,29.25 28.88,28 R701.1 29,27.75 30.38,27.75 v32.62,25.5 32.88,25.5 v36.38,29 | v47.75,56 47.75,54 51,50.75 D921.A | v42.25,36 42.25,35.62 | v79.25,43.75 61.88,43.75 55.62,50 51,50 D921.A
ADC_PHASE  (via drill 0.35)
  Top 0.3: U5.1 57,35.25 55,35.25 v55,35.5 v55,56.12
  Bottom 0.3: v55,35.5 54.75,35.25 53.38,35.25 R501.1 | 21.25,59.88 21.25,59.62 19.75,59.62 15.25,55.12 15.25,54.62 U1.24 | 21.25,59.88 21.25,62.12 R141.2 | v55,56.12 51.62,59.5 51.62,65.38 31.62,65.38 26.12,59.88 21.25,59.88
ADC_PHASE_SAMPLEHOLD  (via drill 0.35)
  Top 0.3: v57.12,30.38 57.12,33.25 U5.3
  Bottom 0.3: C411.1 67,29.25 R412.2 67,31.88 67,32.88 66.12,33.75 60.62,33.75 57.25,30.38 v57.12,30.38 57.12,29 R411.2
AIN1
  Top 0.3: R132.1 33.12,42.88 35.5,42.88 R131.2 35.5,43 35.5,46.88 U1.13
AREF
  Bottom 0.3: C102.1 22.5,58.38 22.5,54.88 22.75,54.62 U1.21
AVCC  (via drill 0.35)
  Top 0.3: v25.38,60.75 25.38,54.62 U1.20
  Bottom 0.3: L101.1 26.12,66 26.25,65.88 26.25,62.25 C101.2 26.25,62.12 26.25,61.62 v25.38,60.75
C_2MHZ5
  Top 0.3: U3.1 79.38,19.38 64.88,19.38 63.12,17.62 U2.38
C_10KHZ  (via drill 0.35)
  Top 0.3: v50.75,64.5 51.5,65.25 52,65.25 CON2.8 | v52.25,7.75 54.25,9.75 U2.17
  Bottom 0.3: v50.75,64.5 37.25,64.5 34.25,61.5 34.25,53.25 30,49 22.5,49 22.25,48.75 21.5,48.75 | 21.5,48.75 21,48.75 20.75,49 19.75,49 17.75,47 U1.6 | v52.25,7.75 48.25,7.75 44,12 44,16.75 38,22.75 16,22.75 12,26.75 12,38.5 15.25,41.75 19.5,41.75 20.75,43 20.75,45 21.5,45.75 21.5,48.75
C_10MHZ  (via drill 0.35)
  Top 0.3: v63.62,25.38 63.62,20.38 62,18.75 U2.40
  Bottom 0.3: v63.62,25.38 65,26.75 R931.1
C_20MHZ  (via drill 0.35)
  Top 0.3: v64.75,20.25 62.75,18.25 U2.39 | v37.25,31.5 37.25,34.75 37.5,35 37.5,46.25 38,46.75 U1.14
  Bottom 0.3: v64.75,20.25 63.5,20.25 58,25.75 53.5,25.75 53.25,26 51.75,26 51,26.75 43,26.75 42.75,26.5 42.25,26.5 v37.25,31.5
CPLD_GPS_NMEA_RX  (via drill 0.35)
  Top 0.3: v52.88,25 54.75,23.12 54.75,19.88 55.38,19.25 U2.4 | v51.12,25.38 50.88,25.62 v50.88,32.38
  Bottom 0.3: v52.88,25 52.5,25.38 v51.12,25.38 | v50.88,32.38 50.62,32.12 48.38,32.12 R201.2
EN  (via drill 0.35)
  Top 0.3: v43.25,51.75 43.25,50.5 | 43.25,50.5 43.25,50.38 | 43.25,50.5 44,49.75 U6.4
  Bottom 0.3: v43.25,51.75 43.25,58.12 41.62,59.75 R601.2
FB  (via drill 0.35)
  Top 0.3: v44.25,42.5 44.25,46.75 U6.3
  Bottom 0.3: R612.2 46,40.75 v44.25,42.5 44.25,44.25 47.75,47.75 48.25,47.75 R611.2
GATE_IN
  Top 0.3: U2.36 64.25,16.38 65.5,17.62 72.5,17.62 72.5,17.88 73,18.38 74.25,18.38 74.25,14.62 U3.5
GATE_TRIG_OUT
  Top 0.3: U2.31 64.25,11.5 66.12,9.62 70.38,9.62 70.38,8.38 U3.9
GND  (via drill 0.35, 0.35 pad 0.51, 0.6)
  Top 0.508: 86.5,55.1 88.75,55.1 CON7.3 | 86.5,55.1 83.75,55.1 CON7.5 | 83.61,60.16 83.25,60.16 | 83.25,60.16 79.4,60.14 77.55,58.88 | 83.5,60.1 CON7.4 | 28.12,24.5 v25.62,24.5 23,24.5 21.88,25.62 D912.A | 28.12,24.5 28.12,25.62 D911.A | 30.5,10.88 CON5.2 | CON5.2 30.25,10.88 27,7.62 27,6.38 25.5,6.38 JP121.2 | v23.12,35.25 23.12,34.12 D701.A | v48,27.62 46.75,27.62 D151.A | U5.2 57,34.38 55.5,34.38 55.38,34.5 54.5,34.5 54,35 v54,36.62 | v29,42.5 27.88,42.5 U7.2 | v41.88,10.88 40.75,10.88 CON5.10 | CON4.6 10.25,43.88 v10.25,38.88 | v10.12,59 11.38,59 CON6.1 | H904.B2,8 5,66.88 15.12,66.88 16.5,65.5 CON6.6 | v69.38,14.5 70.38,14.5 U3.8 | CON1.4 16.12,26.12 v13.88,26.12 v13.88,23.62 | 44.5,54.62 44.5,53.5 44.75,53.25 48.26,53.25 | 44.5,54.62 44.5,58.75 CON2.1 | 48.26,53.25 49,53.25 54.5,58.75 CON2.9 54.75,58.88 55.38,59.5 55.38,65.38 54.62,65.38 CON2.10 | U7.2 29.21,42.54 | v26.76,44.34 U7.2 | v50.48,36.96 v50.42,42.49 46.81,43.91 | 46.81,43.91 v46.45,44.05 | v89.23,57.59 88.81,57.59 CON7.3 | 86.27,54.44 86.27,54.85 | 86.27,54.85 86.27,55.09 | 86.27,54.85 86.5,54.85 86.5,55.1 | 43.88,40.38 44.75,39.5 44.75,39.25 | 43.88,40.38 43.25,41 43.25,46.75 U6.2 | 44.75,39.25 44.75,33.38 | 44.75,33.38 44.75,33.25 | v35.25,39.5 35.25,40.5 35.5,40.75 R131.1 | 43.88,40.38 46.75,43.25 46.75,43.75 46.81,43.91 | 48.26,53.25 v48.26,50.78 v48.26,50.77 | 25,16.51 25,11.25 23.5,9.75 23.5,8 25.25,6.25 | 25,16.51 25,19 C911.2 | 44.75,33.38 44.5,33.38 44.25,33.12 C613.2 44.13,30.48 v44.45,30.48 | C211.2 44.25,54.62 44.5,54.62 | 28.12,24.5 28.12,24.25 30.75,21.62 30.75,19.12 C151.2 30.5,19.12 30.5,11.12 CON5.2 | 44.75,39.25 C612.2 | v24.13,16.51 25,16.51
  Top 0.508: 88.75,60.14 85.11,60.14 | 85.11,60.14 83.7,60.14 | 83.46,60.14 83.7,60.14 | 83.7,60.14 CON7.4 | 75.94,56.25 75.94,55.53 75.94,53.34 75.94,52.33 U8.17 78.74,52.33 | 75.94,56.25 76.06,56.33 77.43,56.33 U8.20 | U8.22 76.14,58.83 76.12,58.85 75.94,58.87 | 75.94,58.87 75.94,57.91 75.94,56.25 | v65.95,60.94 65.96,60.95 65.96,57.91 65.96,56.25 65.96,55.53 65.96,53.34 65.95,52.33 U8.6 v62.37,52.34 | 75.94,58.87 v75.92,60.96 | 88.75,60.24 88.75,59.69 | 88.75,59.69 88.75,54.95 CON7.3 | CON7.2 88.75,59.69 | H903.B2,8 85.11,60.14 | 78.74,52.33 78.99,52.33 80.24,51.08 80.24,48.99 C891.2 | v79.49,52.33 77.69,52.31 78.74,52.33 | v85.58,60.63 85.58,60.61 85.11,60.14 | v47.77,5.4 SJ201.1 | 83.25,60.16 83.25,60.25 CON7.4 | C921.- 86.62,38 85.5,36.88 85.5,30.5 CON3.3
  Bottom 0.508: v13.88,26.12 13.88,26.75 13.38,27.25 13.38,30.62 14.88,30.62 17.62,27.88 17.62,25.75 19,25.75 R913.1 | 54.12,38.12 54.12,38.3 | C591.2 52.75,38.25 52.75,38.3 | v10.25,38.88 11.25,37.88 11.25,26.5 13.88,23.88 v13.88,23.62 | C591.2 53.38,38.5 53.22,38.54 53.25,38.5 C591.2 | v35.25,39.5 33.25,41.5 31.75,41.5 C152.2 | 50.5,37.75 50.48,37.75 | 49.62,37 49.55,37.05
  other vias: 86.25,54.41
  pour Bottom: 80,69.85 90,69.85 90,20 90.17,20.32 90.17,0 0,0 0,69.85 59.54,69.85
  pour Bottom: 58.42,20 64,14 58.42,8 52.5,14
GND_SJ1
  Top 0.3: 62,9.25 U2.27 61.88,9.38 61.25,10 61,10 | 52.14,13.99 55.55,17.45 55.5,18.12 55,18.62 U2.5 | 52.14,13.99 51.5,13.5 51.5,12.75 U2.12 | 58.47,7.66 60.88,10 61,10 | 58.47,7.66 58.5,7.62 58.5,7.38 57,5.88 52.88,5.88 51.5,7.25 45.75,7.25 SJ201.2 | U2.34 65.25,15.12 65.25,14.38 61,10.12 61,10 | 58.47,7.66 52.14,13.99
GPS_ANT_PWR
  Top 0.508: CON2.4 46.88,65.5 45.5,66.88 40.75,66.88 40.75,66.25 RPOLY2.1
GPS_HF
  Top 0.3: 86.02,57.58 CON7.1 | 79.31,57.6 77.75,57.6 77.62,57.62 77.5,57.62 U8.21 | LFP811.1 80.38,57.88 80.37,57.6
  Top 2.1: 79.31,57.6 80.37,57.6 86.02,57.58
GPS_NMEA_RX  (via drill 0.35)
  Top 0.3: v58,42.75 61.38,46.12 61.38,52.62 | 61.38,52.62 62.5,53.75 64.38,53.75 U8.5 | v49.75,57.5 49.75,58.75 49.62,58.88 CON2.5 | v61.25,52.88 61.38,52.75 61.38,52.62
  Bottom 0.3: v58,42.75 52.75,42.75 49.38,39.38 48.38,39.38 48.38,34 R201.1 | v49.75,57.5 54.38,52.88 v61.25,52.88
GPS_NMEA_TX  (via drill 0.35)
  Top 0.3: 56.12,58.5 52.88,55.25 52.88,48.62 52,47.75 52,19.12 53.5,17.62 53.75,17.62 U2.7 | 56.12,58.5 56.12,65.88 54.62,67.38 49.62,67.38 49.62,65.5 CON2.6 | v61.25,55.12 64.38,55.12 U8.4 | v56.25,58.5 56.12,58.5
  Bottom 0.3: v61.25,55.12 57.88,58.5 v56.25,58.5
GPS_PPS  (via drill 0.35)
  Top 0.3: v53.25,66.5 53.25,60 52.25,59 CON2.7 52,58.75 52,58.5 49,55.5 49,54.25 v46.75,54.25 | v51.62,10.38 51.62,9.75 53.12,9.75 53.75,10.38 U2.16 | v50.5,18.88 50.25,19.12 50.25,31.75 49.38,32.62 v49.38,38.5 | v55.88,41.88 60.38,46.38 60.38,55.5 61.12,56.25 | 61.12,56.25 64.38,56.25 U8.3 | 61.12,56.25 v61.12,58
  Bottom 0.3: v53.25,66.5 53.25,65.88 v61.12,58 | v46.75,54.25 46.75,52.25 44.5,50 36,50 34.75,48.75 33.25,48.75 33.25,47 U1.12 | v51.62,10.38 51.62,15.5 49.88,15.5 49.38,16 49.38,18.12 49.75,18.12 v50.5,18.88 | v49.38,38.5 52.75,41.88 v55.88,41.88
GPS_RESET  (via drill 0.35)
  Top 0.3: v53.5,28.75 55.38,26.88 55.38,20.5 56,19.88 U2.3 | v64.38,38.75 64.38,45.75 U8.11
  Bottom 0.3: v53.5,28.75 53.75,29 55.12,29 56.25,30.12 56.25,31 56.5,31 58.75,33.25 58.88,33.25 v64.38,38.75
GPS_VBACKUP  (via drill 0.35)
  Top 0.3: 44.5,65.38 CON2.2 44.62,65.38 46.25,63.75 v46.25,61.88 | C921.+ 78.38,38.12 78.38,44.88 77.5,45.75 U8.12 77.38,45.75 v76.38,44.75
  Bottom 0.3: v46.25,61.88 46.25,56.88 48.12,56.88 50.75,54.25 50.75,53.88 D921.C 50.88,53.75 52.38,52.25 54.38,52.25 61.38,45.25 75.88,45.25 v76.38,44.75
INT1
  Top 0.152: JP121.1 25.5,8.88 25.5,9
  Top 0.3: 25.5,9 26.62,10.12 26.62,22.62 25.62,23.62 19.38,23.62 19.38,41 15.25,45.12 15.25,46.88 U1.5
ISP_MISO  (via drill 0.35)
  Top 0.3: v8,49.38 8,50.25 5.88,50.25 3.88,48.25 3.88,43.12 4.75,42.25 4.75,37.75 5,37.5 CON4.1 | v21.88,49.62 24.88,52.62 26.75,52.62 26.75,57.5 v29,59.75
  Bottom 0.3: v8,49.38 8.25,49.62 v21.88,49.62 | v29,59.75 29.88,60.62 30.38,60.62 R122.1
ISP_MOSI  (via drill 0.35)
  Top 0.3: v11.88,51.12 9,48.25 9,45.38 7.62,44 CON4.4
  Bottom 0.3: v11.88,51.12 30.38,51.12 33,53.75 33,54.5 U1.17
ISP_SCK  (via drill 0.35)
  Top 0.3: v6.75,49.38 6.38,49 6.38,43.12 6.88,42.62 6.88,38.12 7.5,37.5 CON4.3
  Bottom 0.3: v6.75,49.38 9.38,52 22.62,52 24.12,53.5 24.12,56.88 25.62,58.38 R123.2
ISP_VTARGET  (via drill 0.35)
  Top 0.152: JP941.2 19.12,6.38 19,6.38
  Top 0.3: v12.12,24.12 6.25,30 6.25,38 5.75,38.5 5.75,43.25 5.12,43.88 CON4.2 | v13.88,22.38 17.07,19.18 17.07,8.31 19,6.38
  Bottom 0.3: v13.88,22.38 v12.12,24.12
JTAG_SRST  (via drill 0.35)
  Top 0.152: JP111.2 12.75,6.38 12.75,6.25
  Top 0.3: 14.7,4.64 12.75,4.64 12.75,6.25 | 14.7,4.64 26.86,4.62 28.57,6.66 29.5,7.65 33.62,7.65 34,8.62 34,10.75 35.5,10.75 CON5.6 | 13,37.38 13.38,37.38 13.38,26.88 13,26.5 13,22 14.7,20.3 14.7,4.64 | 13,37.38 10.25,37.38 CON4.5 | v53.75,49 53.75,46 53,45.25 53,30.5 59.5,24 59.5,21 U2.44 | v51.75,48.75 47.5,48.75 45.25,51 v44.25,51 | v13,38 13,37.38
  Bottom 0.3: v53.75,49 52,49 v51.75,48.75 | R121.2 35.75,60.75 36,61 42.5,61 44.25,59.25 v44.25,51 44,50.75 34.25,50.75 31.75,48.25 31.75,45.75 31,45 30.25,45 26,40.75 15.25,40.75 13,38.5 v13,38
JTAG_TCK  (via drill 0.35)
  Top 0.3: v32,5.88 30.5,4.38 CON5.1 | v35.12,7.88 37.12,7.88 37.12,11.88 43.38,18.12 v46.12,18.12 | v47.88,19.88 49,18.75 49,17.75 49.5,17.25 50.75,17.25 50.75,17.12 52,15.88 U2.10
  Bottom 0.3: v32,5.88 33.12,5.88 v35.12,7.88 | v47.88,19.88 v46.12,18.12
JTAG_TDI  (via drill 0.35)
  Top 0.3: v45.12,17.25 39.38,11.5 39.38,4.38 40.62,4.38 CON5.9 | v56.25,22.12 57.12,21.25 57.12,21 U2.1
  Bottom 0.3: v45.12,17.25 46.75,17.25 51.62,22.12 v56.25,22.12
JTAG_TDO  (via drill 0.35)
  Top 0.3: v58.38,2.38 58.38,1.88 38.62,1.88 37.12,3.38 37.12,7 35,7 34.88,6.88 34.88,6.12 33.12,4.38 CON5.3 | v66.12,10.88 64.88,12.12 U2.32
  Bottom 0.3: v58.38,2.38 66.12,10.12 v66.12,10.88
JTAG_TMS
  Top 0.3: CON5.5 35.46,4.16 36.34,3.29 36.5,3.12 38.38,1.25 59.25,1.25 59.25,6.62 59.62,7 U2.23
JTAG_VREF  (via drill 0.35)
  Top 0.3: v34,13.88 34,11.75 33.12,10.88 CON5.4
  Bottom 0.3: v34,13.88 38.12,18 R951.1
MCU_RXD  (via drill 0.35)
  Top 0.3: v51.12,23.38 51.38,23.12 51.38,18.75 53.12,17 U2.8 | v49.38,25.12 49,25.5 49,28.16 48.26,28.78 47.71,28.78 42.67,28.74 41.5,28 41.5,27.25 41.75,27 41.75,23.75 38.5,20.5 37.5,20.5 37.25,20.75 v36,20.75
  Bottom 0.3: v49.38,25.12 v51.12,23.38 | v36,20.75 33.25,18 13.5,18 3,28.5 3,47.5 4.5,49 5.5,49 7.5,47 U1.2
MCU_TXD  (via drill 0.35)
  Top 0.3: v47.88,21.12 49.62,19.38 49.62,18 50.88,18 52.5,16.38 U2.9 | v14.38,29.62 14,30 14,38.25 11.12,41.12 11.12,46 10.25,46.88 U1.3
  Bottom 0.3: v47.88,21.12 45.62,23.38 18.25,23.38 14.38,27.25 v14.38,29.62
MISO
  Bottom 0.3: R122.2 30.5,58.62 30.5,54.62 U1.18
N$1
  Top 0.3: CON6.2 11.38,65.38 8.12,65.38 8.12,59.75 5.12,56.75 5.12,54.62 U1.28
N$2
  Top 0.508: U8.19 80.18,55.08 LFP811.2
N$3
  Top 0.3: CON6.4 13.88,65.38 12.5,65.38 12.5,63.25 7.62,58.38 7.62,54.62 U1.27
N$42  (via drill 0.35)
  Top 0.3: v68.38,26.75 77.62,26.75 CON3.1
  Bottom 0.3: v68.38,26.75 67,26.75 R931.2
N$44  (via drill 0.3)
  Top 0.152: v71.5,17 71.5,15 U3.7
  Bottom 0.152: R311.1 71.5,21.5 71.5,19.5 C311.2 71.5,19 v71.5,17
N$45  (via drill 0.35)
  Top 0.3: v73.38,17.5 73.12,17.25 73.12,14.62 U3.6
  Bottom 0.3: v73.38,17.5 73.38,19 C311.1
N$47  (via drill 0.35)
  Top 0.3: v78.62,6.62 78.5,6.75 78.5,7.88 78.12,8.25 U3.15
  Bottom 0.3: R301.1 73.38,5.12 75.25,7 76.75,7 78.38,5.38 78.38,5.12 C301.2 78.38,5.5 78.62,5.75 v78.62,6.62
N$48  (via drill 0.35)
  Top 0.3: v76.62,3.5 76.75,3.62 76.75,8.25 U3.14
  Bottom 0.3: v76.62,3.5 76.62,5 C301.1
N_ADC_PULL  (via drill 0.35)
  Top 0.3: v34.62,38.38 34.62,29.38 38.25,25.75 D152.A 38.5,25.62 38.5,24.25 v40.75,24.25 | v43.38,25.75 45.62,25.75 D151.C | 30.19,36.31 31.75,34.75 31.75,25.12 32.62,24.25 32.62,19.12 C151.1 | 30.19,36.31 27.88,38.62 U7.1 27.88,38.88 27.88,40 24.12,40 19.12,45 19.12,53.25 17.88,54.5 U1.23 | v30.62,36.88 30.25,36.5 30.25,36.38 30.19,36.31
  Bottom 0.3: v34.62,38.38 33.38,39.62 31.75,39.62 C152.1 32,39.5 32,36.88 R151.2 31.88,36.88 v30.62,36.88 | v43.38,25.75 41.88,24.25 v40.75,24.25
N_PWM_PULL_3V3  (via drill 0.35)
  Top 0.3: v54,30.75 60.88,23.88 60.88,20.88 60.38,20.38 U2.43
  Bottom 0.3: v54,30.75 52,30.75 51.75,30.5 47.75,30.5 47.5,30.25 47,30.25 43,34.25 37.12,34.25 36.88,34.5 36.88,35.38 35.5,36.75 34,36.75 R151.1
N_PWM_PULL_5V0  (via drill 0.35)
  Top 0.3: v58.5,34.12 60.5,34.12 61.5,33.12 61.5,20.5 60.88,19.88 U2.42 | v40.38,33.38 39.38,34.38 39.38,55.75 38.62,56.5 31.75,56.5 31.75,48.25 30.5,47 U1.11
  Bottom 0.3: v58.5,34.12 54.88,30.5 54.88,29.62 46.62,29.62 42.88,33.38 v40.38,33.38
N_USB_DISC  (via drill 0.35)
  Top 0.3: v35.62,34 36.88,35.25 36.88,53.38 38,54.5 U1.15 | v50.12,11.5 51.38,11.5 52,12.12 U2.13 | v47.25,14.38 47,14.62 47,18.62 42.5,23.12 v42.5,27.5
  Bottom 0.3: R914.2 29.25,34 v35.62,34 36,34 v42.5,27.5 | v47.25,14.38 v50.12,11.5
N_USB_DMNS  (via drill 0.35)
  Top 0.3: v17.5,35.25 14.62,38.12 14.62,38.5 12.75,40.38 12.75,46.88 U1.4 12.75,47.12 12.75,52 10.25,54.5 U1.26
  Bottom 0.3: v17.5,35.25 19,35.25 R916.2
N_USB_DPLS  (via drill 0.35)
  Top 0.3: v15.12,39.25 13.88,40.5 13.88,53.38 12.75,54.5 U1.25
  Bottom 0.3: v15.12,39.25 15.12,37.88 R915.2
PHASE_ERROR
  Bottom 0.3: D401.C 53.38,27.25 56.88,27.25 57.12,27 R411.1
PHASE_RSFF  (via drill 0.35)
  Top 0.3: 64.88,15.88 U2.35 64.88,16 65.62,16.75 v66,16.75
  Bottom 0.3: D401.A 59.25,23.5 v66,16.75
RESET  (via drill 0.35)
  Top 0.152: JP111.1 12.62,8.88 12.62,9
  Top 0.3: 12.62,9 3.88,17.75 v3.88,41.75
  Bottom 0.3: 6.69,44.56 5.12,46.12 5.12,46.88 U1.1 | 6.69,44.56 8,43.25 16.75,43.25 R111.2 | 6.69,44.56 v3.88,41.75
SCK
  Bottom 0.3: R123.1 27.5,58.38 27.5,55 27.88,54.62 U1.19
SS
  Bottom 0.3: R121.1 35.62,58.62 35.62,54.62 U1.16
SW  (via drill 0.35)
  Top 0.508: v40.88,42.25 40.88,45.62 42.12,46.88 U6.1 42.25,47 42.25,47.75 42.75,48.25 44.75,48.25 48,45 v51,45
  Bottom 0.508: v40.88,42.25 39.25,40.62 L611.2 | v51,45 53.25,47.25 D611.C
SYNC_IN  (via drill 0.35)
  Top 0.3: v65.5,18.5 65.25,18.5 63.75,17 U2.37 | v68.25,8.75 69.62,7.38 69.62,7 70.88,5.75 75.5,5.75 75.5,8.25 U3.13
  Bottom 0.3: v65.5,18.5 68.25,15.75 v68.25,8.75
TOSC1
  Top 0.3: U7.3 25.5,42.62 25.5,46.88 U1.9
U5_FB  (via drill 0.35)
  Top 0.3: v54.5,32 56.12,30.38 56.12,29.5 57.5,29.5 58,30 58,31.62 59.62,33.25 U5.4
  Bottom 0.3: v54.5,32 53.25,33.25 R501.2
USB_D_MIN  (via drill 0.35)
  Top 0.3: v29.25,30.62 29.25,29.38 | 29.25,29.38 29.25,27.75 D911.C | v17.5,33.25 18.38,32.38 18.38,28.25 17.5,27.38 16.25,27.38 CON1.2 | v25.62,29.38 29.25,29.38
  Bottom 0.3: v29.25,30.62 29.25,32 R914.1 | v17.5,33.25 19,33.25 R916.1 19.12,33.25 21.75,33.25 v25.62,29.38
USB_D_PLS  (via drill 0.35)
  Top 0.3: v20.62,27.75 22.75,27.75 D912.C | v17.5,29.88 16.25,28.62 CON1.3
  Bottom 0.3: v20.62,27.75 20.5,27.62 19.12,27.62 R913.2 19.75,27.75 17.56,29.94 | 17.56,29.94 15.25,32.25 R915.1 | v17.5,29.88 17.56,29.94
USB_PWR
  Top 0.3: RPOLY1.1 19,21.75 16.25,24.5 16.25,24.75 CON1.1
VCC  (via drill 0.3, 0.35)
  Top 0.508: 59.62,35.25 U5.5 | v71.25,6.62 71.75,7.12 71.75,8.25 U3.10 72,8.38 73,8.38 U3.11 | U3.3 76.88,14.5 78,14.5 U3.2 78.12,14.75 78.38,15 v78.38,16.25 | U3.16 79.38,8.38 80.5,9.5 80.5,10.62 v83.5,13.62 83.5,28 70.5,28 63.5,35 59.75,35 U5.5 | 19.12,19 RPOLY1.2 | U6.5 42.12,49.62 41.75,50 41.75,53.25 41.5,53.5 41.5,54.62 | 41.5,54.62 41.5,56.38 v39.75,58.12 39.5,58.12 36.38,61.25 26.38,61.25 24.12,63.5 23.88,63.5 | CON5.7 38.12,4.25 39.38,3 v42.12,3 42.12,2.75 v56.5,2.75 | 24.12,41.62 24.12,43.12 20.38,46.88 U1.7 20.5,47.12 20.5,49.75 24.12,53.38 24.12,56.62 23.88,56.62 | 24.12,41.62 24.12,41 33,41 R132.2 33.12,40.75 33.62,40.25 33.62,25.75 v38,21.38 | v23.88,41.62 24.12,41.62 | 23.88,56.62 16.25,56.62 14,58.88 CON6.3 | 23.88,56.62 23.88,63.5 | 23.88,63.5 v23.88,64.38 | v58.5,36.25 59.5,35.25 U5.5 | C911.1 23.12,19 19.38,19 RPOLY1.2 | 41.5,54.62 42.12,54.62 C211.1 | RPOLY1.2 19,18.5 v19,13 19,9 19.12,8.88 JP941.1
  Bottom 0.508: C591.1 53.38,40.25 54.62,40.25 54.88,40 58.5,40 | C391.1 85,13.62 v83.5,13.62 83.25,13.62 80.62,16.25 80.38,16.25 | 80.38,16.25 v78.38,16.25 78.5,16.5 73.5,21.5 R311.2 | 80.38,16.25 80.38,16 71.25,6.88 v71.25,6.62 71.38,6.5 71.38,5.12 R301.2 71.12,5.12 62.62,5.12 58.88,1.38 57.88,1.38 v56.5,2.75 | 58.62,40 58.5,40 | v39.75,58.12 39.75,59.62 R601.1 | v42.12,3 43,3.88 43.5,3.88 C491.1 43.12,4.12 43.12,15.38 38.25,20.25 R951.2 | v38,21.38 38,20 R951.2 | R111.1 18.75,43.25 18.75,44.38 20.25,45.88 20.25,46.88 U1.7 | v23.88,41.62 23.88,43.12 C191.1 | v23.88,64.38 22.25,66 L101.2 | R951.2 36.75,20 31,14.25 19.38,14.25 C912.1 19,14 v19,13 | v58.5,36.25 58.5,40
VCC_3V3_SJ2  (via drill 0.35)
  Top 0.3: 62.5,10 U2.28 62.62,9.75 63.5,8.88 v63.5,8.75 | 54.5,18 U2.6 54.25,18.12 v53.25,19.12 | SJ202.1 45.75,12.5 49.25,12.5 49.25,13.12 51.38,15.25 U2.11 51.25,15.25 50.25,16.25 v50.25,16.38 | v66,13.5 65.38,12.88 65.38,12.75 U2.33
  Bottom 0.3: v63.5,8.75 63.5,12.12 64.62,12.12 v66,13.5 65.88,13.5 58.62,20.75 55,20.75 53.38,19.12 v53.25,19.12 53,19.12 v50.25,16.38

### Text on the board
Top: Top
Bottom: Bot
tPlace: I2C | GPS-TPs | GPS-Ant. / MCX | SPI | 10 MHz / Ref-Out | USB-B | JTAG | DW | VT | BL
bNames: DF4IAH / 10 MHz Ref.-Osc. / V 2.3b